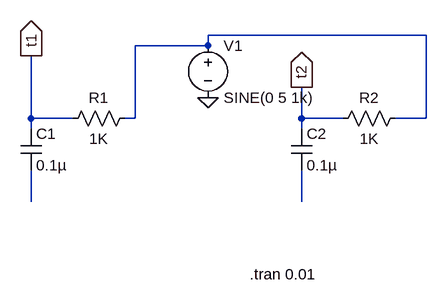
[diagram p0: schematic CapTesting.asc]
CapTesting.asc, the LTspice schematic file:
Version 4
SHEET 1 880 680
WIRE 576 -160 240 -160
WIRE 240 -144 240 -160
WIRE 240 -144 128 -144
WIRE -32 -32 -32 -128
WIRE 32 -32 -32 -32
WIRE 128 -32 128 -144
WIRE 128 -32 112 -32
WIRE 384 -32 384 -80
WIRE 448 -32 384 -32
WIRE 576 -32 576 -160
WIRE 576 -32 528 -32
WIRE -32 -16 -32 -32
WIRE 384 -16 384 -32
WIRE -32 96 -32 48
WIRE 384 96 384 48
FLAG 240 -64 0
FLAG -32 -128 t1
IOPIN -32 -128 Out
FLAG 384 -80 t2
IOPIN 384 -80 Out
SYMBOL res 128 -48 R90
WINDOW 0 0 56 VBottom 2
WINDOW 3 32 56 VTop 2
SYMATTR InstName R1
SYMATTR Value 1K
SYMBOL res 544 -48 R90
WINDOW 0 0 56 VBottom 2
WINDOW 3 32 56 VTop 2
SYMATTR InstName R2
SYMATTR Value 1K
SYMBOL cap -48 -16 R0
SYMATTR InstName C1
SYMATTR Value 0.1µ
SYMBOL cap 368 -16 R0
SYMATTR InstName C2
SYMATTR Value 0.1µ
SYMBOL voltage 240 -160 R0
WINDOW 123 0 0 Left 0
WINDOW 39 0 0 Left 0
SYMATTR InstName V1
SYMATTR Value SINE(0 5 1k)
TEXT 304 208 Left 2 !.tran 0.01

The netlist it stands for:
* CapTesting.asc
R1 N001 t1 1K
R2 N001 t2 1K
C1 t1 N002 0.1µ
C2 t2 N003 0.1µ
V1 N001 0 SINE(0 5 1k)
.tran 0.01
.backanno
.end